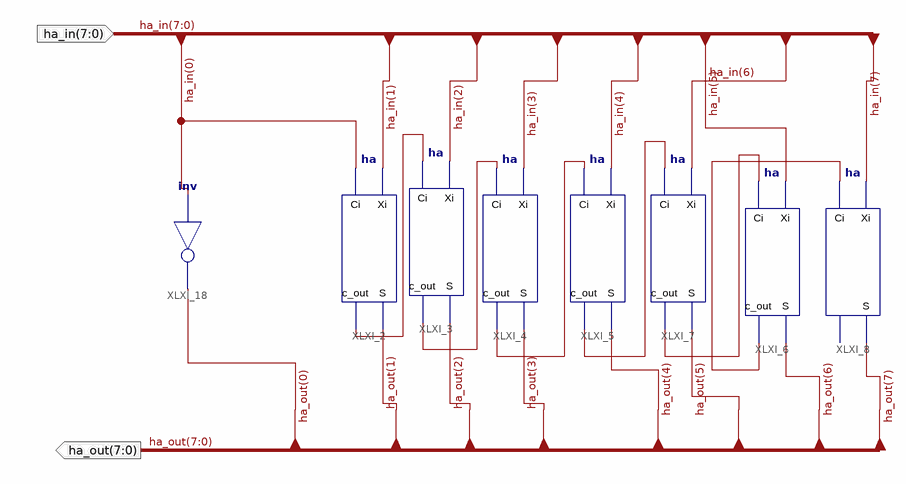
[diagram p0: schematic sheet 1]
// Xilinx ISE schematic ha_8bit.sch (spartan3e) as structural Verilog: 8 symbols, 2 ports
module ha_8bit (
  input  [7:0] ha_in,
  output [7:0] ha_out
);

  wire XLXN_17, XLXN_18, XLXN_19, XLXN_37, XLXN_38, XLXN_39;

  ha XLXI_2 (.Xi(ha_in[1]), .Ci(ha_in[0]), .S(ha_out[1]), .c_out(XLXN_17));
  ha XLXI_3 (.Xi(ha_in[2]), .Ci(XLXN_17), .S(ha_out[2]), .c_out(XLXN_18));
  ha XLXI_4 (.Xi(ha_in[3]), .Ci(XLXN_18), .S(ha_out[3]), .c_out(XLXN_19));
  ha XLXI_5 (.Xi(ha_in[4]), .Ci(XLXN_19), .S(ha_out[4]), .c_out(XLXN_37));
  ha XLXI_6 (.Xi(ha_in[5]), .Ci(XLXN_38), .S(ha_out[6]), .c_out(XLXN_39));
  ha XLXI_7 (.Xi(ha_in[6]), .Ci(XLXN_37), .S(ha_out[5]), .c_out(XLXN_38));
  ha XLXI_8 (.Xi(ha_in[7]), .Ci(XLXN_39), .S(ha_out[7]));  // open: c_out
  not XLXI_18 (ha_out[0], ha_in[0]);
endmodule
